# Altium schematic sheet Reset_Switch.SchDoc
size A4
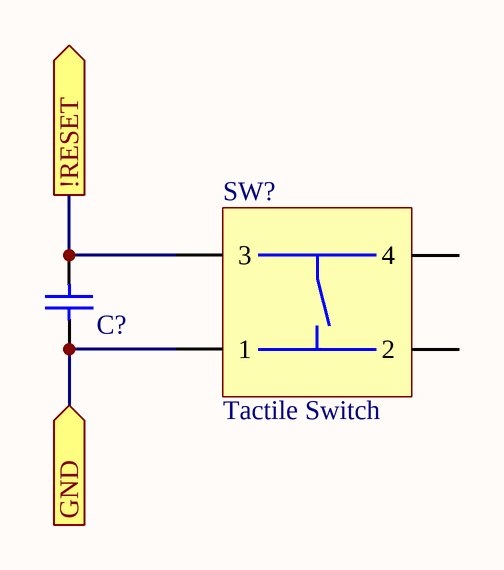
[diagram p0: Reset_Switch.SchDoc]

## Parts
C?  0603 Cap  [0603 Capacitor]  (value not drawn)
SW?  Tactile Switch  [PCBComponent]

## Ports
!RESET (out), GND (in)

## Nets
!RESET: C?.2 SW?.3 ; port !RESET
GND: C?.1 SW?.1 ; port GND

Not connected (* = marked no-connect by the designer): SW? 2 4

## Library data of the parts
C? = CMP-001-A20-6: value: *
SW? = CMP-001-E74-5: Tactile Switch, 24V, 50 mA, Pushbutton - N.O, 2-1437565-8